# Altium project PCB-Power-Management.PrjPcb
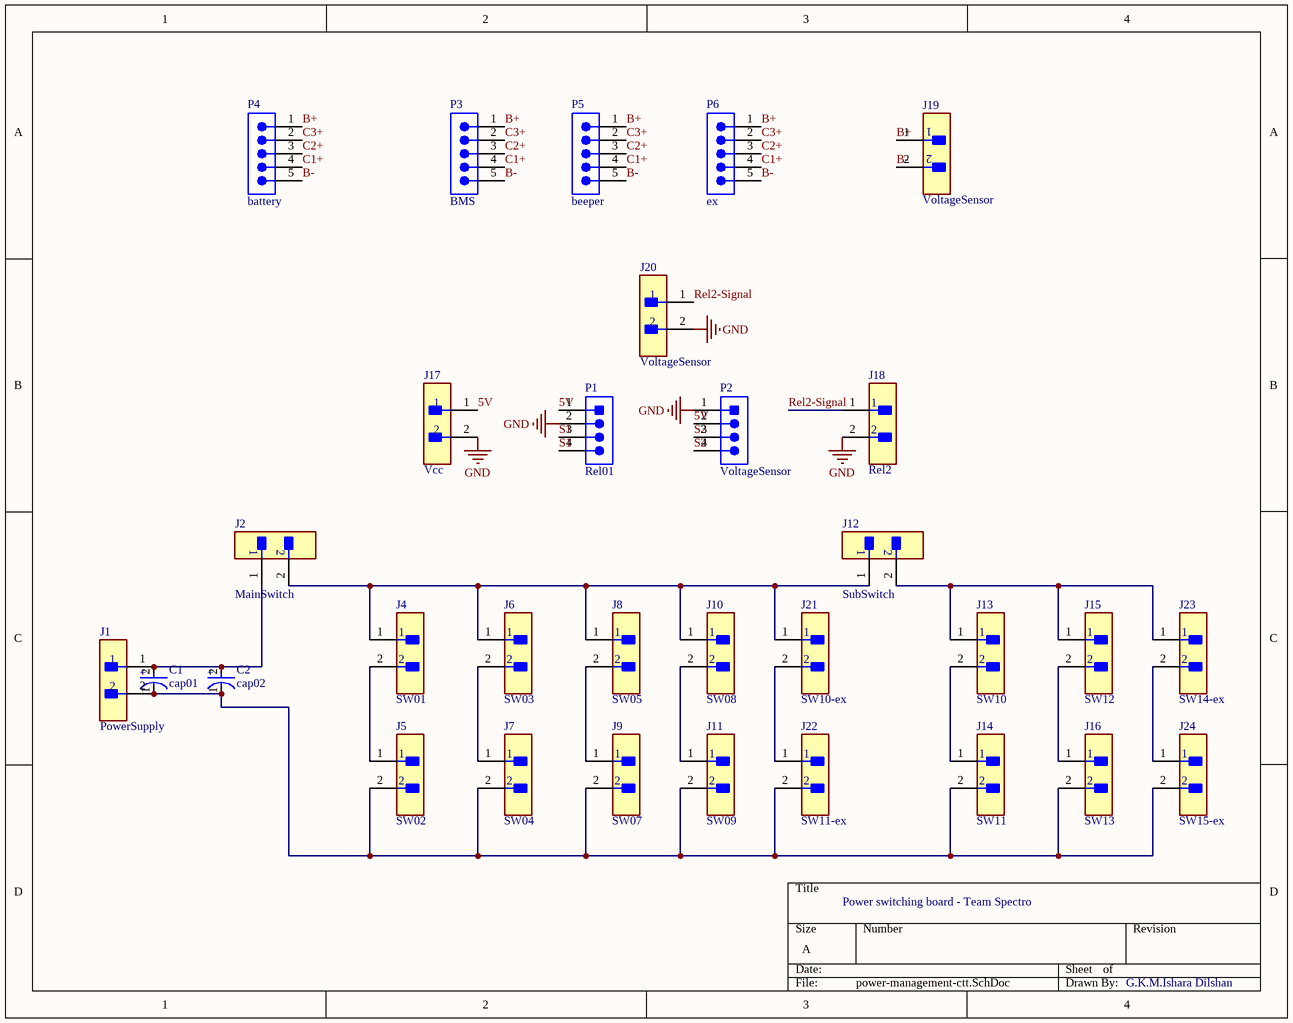
[diagram p0: power-management-ctt.SchDoc]
1 sheet, 31 parts. Net scope: global (net labels, ports and power ports of the same name join across sheets).
Board file: PCB-Power-Managemet-pcb.PcbDoc

## Sheet power-management-ctt.SchDoc
size A; SheetNumber: 1; SheetTotal: 1

### Parts
C1  cap01  [FP-RAD-TH-D_16_0_5-L_25_2-MFG]
C2  cap02  [FP-RAD-TH-D_16_0_5-L_25_2-MFG]
J1  PowerSupply  [FP-M20-9990245-MFG]
J2  MainSwitch  [FP-M20-9990245-MFG]
J4  SW01  [FP-M20-9990245-MFG]
J5  SW02  [FP-M20-9990245-MFG]
J6  SW03  [FP-M20-9990245-MFG]
J7  SW04  [FP-M20-9990245-MFG]
J8  SW05  [FP-M20-9990245-MFG]
J9  SW07  [FP-M20-9990245-MFG]
J10  SW08  [FP-M20-9990245-MFG]
J11  SW09  [FP-M20-9990245-MFG]
J12  SubSwitch  [FP-M20-9990245-MFG]
J13  SW10  [FP-M20-9990245-MFG]
J14  SW11  [FP-M20-9990245-MFG]
J15  SW12  [FP-M20-9990245-MFG]
J16  SW13  [FP-M20-9990245-MFG]
J17  Vcc  [FP-M20-9990245-MFG]
J18  Rel2  [FP-M20-9990245-MFG]
J19  VoltageSensor  [FP-M20-9990245-MFG]
J20  VoltageSensor  [FP-M20-9990245-MFG]
J21  SW10-ex  [FP-M20-9990245-MFG]
J22  SW11-ex  [FP-M20-9990245-MFG]
J23  SW14-ex  [FP-M20-9990245-MFG]
J24  SW15-ex  [FP-M20-9990245-MFG]
P1  Rel01  [MOLX-22-27-2041_V]
P2  VoltageSensor  [MOLX-22-27-2041_V]
P3  BMS  [691311500105]
P4  battery  [691311500105]
P5  beeper  [691311500105]
P6  ex  [691311500105]

### Nets
GND: J17.2 J18.2 J20.2 P1.2 P2.1
5V: J17.1 P1.1 P2.2
B+: J19.1 P3.1 P4.1 P5.1 P6.1
B-: J19.2 P3.5 P4.5 P5.5 P6.5
C1+: P3.4 P4.4 P5.4 P6.4
C2+: P3.3 P4.3 P5.3 P6.3
C3+: P3.2 P4.2 P5.2 P6.2
Rel2-Signal: J18.1 J20.1
S1: P1.3 P1.4
S2: P2.3 P2.4
NetC1_1: C1.1(C) C2.1(C) J1.2 J5.2 J7.2 J9.2 J11.2 J14.2 J16.2 J22.2 J24.2
NetC1_2: C1.2(A) C2.2(A) J1.1 J2.1
NetJ2_2: J2.2 J4.1 J6.1 J8.1 J10.1 J12.1 J21.1
NetJ4_2: J4.2 J5.1
NetJ6_2: J6.2 J7.1
NetJ8_2: J8.2 J9.1
NetJ10_2: J10.2 J11.1
NetJ12_2: J12.2 J13.1 J15.1 J23.1
NetJ13_2: J13.2 J14.1
NetJ15_2: J15.2 J16.1
NetJ21_2: J21.2 J22.1
NetJ23_2: J23.2 J24.1

### Notes on the sheet
- Power switching board - Team Spectro
- G.K.M.Ishara Dilshan
- (in symbol CMP-05427-000445-1) +

### Library data of the parts
C1 C2 = CMP-05427-000445-1: Aluminum Electrolytic Capacitors (Radial Lead Type) 4700uF ±20% 16V; Impedance: 14mR; Ripple Current (AC): 3.82A; Life (Hours): 10000Hour; Lead/Base Style: Straight; Capacitance: 4.7mF; Lead Diameter: 0.8mm; RoHS Compliant: Yes; Termination: Radial; Voltage Rating: 16V; Number of Pins: 2; Max Operating Temperature: 105°C; Packaging: Bulk; Ripple Current: 3.82A; Radiation Hardening: No; Tolerance: 20%; Mount: Through Hole; Series: FR; Diameter: 16mm; Case/Package: Radial; Voltage: 16V; Lead Pitch: 7.5mm; Construction: RADIAL; Contact Plating: Tin; Package Quantity: 100; Voltage Rating (DC): 16V; Length: 25mm; ESR (Equivalent Series Resistance): 14mR; REACH SVHC: No SVHC; Min Operating Temperature: -40°C; Height: 25mm; Height - Seated (Max): 1.063inch
J1 J2 J4-J24 = CMP-15831-000105-1: CONN HEADER VERT 2POS 2.54MM; Working Voltage: 750V; Gender: Male; Number of Poles: 2; Current Rating: 3A; Mated Stacking Heights: 16.54mm; Contact Resistance: 25mR; Connector Type: Male Pin; Insulation Resistance: 10GR; Mating Cycles: 300; Voltage: 50V; Flammability Rating: UL94 V-0; Pitch: 2.54mm; Series: M20; Number of Contacts: 2; Height: 0.12inch; Min Operating Temperature: -40°C; Contact Finish - Mating: GOLD; Number of Positions: 2; Number of Rows: 1; Packaging: Bulk; Package Quantity: 1000; Voltage Rating (AC): 750V; Current: 3A; Mount: Through Hole; Case/Package: SIL; Orientation: Straight; Contact Shape: Square; Weight: 0.25lb; Radiation Hardening: No; Fastening Type: Pull; Length: 5.08mm; Depth: 2.54mm; Contact Mating Length: 0.24inch; Housing Material: Nylon; Reach SVHC Compliant: Yes; Insulation Material: Nylon; Color: Black; Width: 0.25inch; Insulation Color: Black; Contact Material: Brass; Contact Type: Male Pin; Termination: Solder; Max Operating Temperature: 105°C; Contact Plating: Gold; Housing Color: Black; Max Current Rating: 3A; Lead Pitch: 2.54mm
P1 P2 = CMP-2000-05243-1: Male Header, Pitch 2.54 mm, 1 x 4 Position, Height 11.7 mm, Tail Length 3.56 mm, RoHS, Bulk; Manufacturer: Molex; Voltage rating: 250V; Current rating: 4A; Datasheet Version: Rev. F, 06/2009; Operating temperature: 0degCto+75degC; Contact material: Tinplatedbrass; Manufacturer URL: http://www.molex.com/; Housing material: Nylon(UL94V-0); Datasheet URL: http://www.molex.com/pdm_docs/sd/022272041_sd.pdf
P3-P6 = CMP-1502-02149-2: NexarPartId: 8917750; Pitch: 5.08mm; Voltage: 300V; Number of Positions Per Level: 5; Number of Levels: 1; Gender: Male; Current: 20A; Height: 12mm; Contact Plating: Tin; Orientation: Vertical; RoHS: Compliant; Width: 27.4mm; Termination: Solder; Mount: Through Hole; Length: 8.5mm; Contact Material: Brass; Number of Contacts: 5; Packaging: Box; Number of Rows: 1; Number of Pins: 5; Lead Pitch: 5.08mm; REACH SVHC: No SVHC; Color: Green